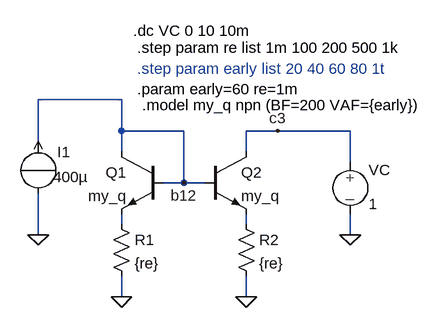
[diagram p0: schematic stromspiegel.asc]
stromspiegel.asc, the LTspice schematic file:
Version 4
SHEET 1 880 680
WIRE 112 0 -16 0
WIRE 112 48 112 0
WIRE 208 48 112 48
WIRE 352 48 304 48
WIRE 464 48 352 48
WIRE -16 64 -16 0
WIRE 112 80 112 48
WIRE 304 80 304 48
WIRE 464 96 464 48
WIRE 208 128 208 48
WIRE 208 128 176 128
WIRE 240 128 208 128
WIRE 112 192 112 176
WIRE 304 192 304 176
WIRE -16 208 -16 144
WIRE 464 208 464 176
WIRE 112 304 112 272
WIRE 304 304 304 272
FLAG 208 128 b12
FLAG 464 208 0
FLAG 352 48 c3
FLAG 304 304 0
FLAG 112 304 0
FLAG -16 208 0
SYMBOL EIT_Semiconductors\\npn 240 80 R0
SYMATTR InstName Q2
SYMATTR Value my_q
SYMBOL source-V 464 80 R0
SYMATTR InstName VC
SYMATTR Value 1
SYMBOL EIT_Semiconductors\\npn 176 80 M0
SYMATTR InstName Q1
SYMATTR Value my_q
SYMBOL source-I -16 64 R0
WINDOW 3 23 55 Left 2
SYMATTR InstName I1
SYMATTR Value 400µ
SYMBOL res 96 176 R0
SYMATTR InstName R1
SYMATTR Value {re}
SYMBOL res 288 176 R0
SYMATTR InstName R2
SYMATTR Value {re}
TEXT 144 8 Left 2 !.model my_q npn (BF=200 VAF={early})
TEXT 136 -16 Left 2 !.param early=60 re=1m
TEXT 136 -48 Left 2 ;.step param early list 20 40 60 80 1t
TEXT 130 -106 Left 2 !.dc VC 0 10 10m
TEXT 136 -80 Left 2 !.step param re list 1m 100 200 500 1k

The netlist it stands for:
* stromspiegel.asc
Q2 c3 b12 N002 0 my_q
VC c3 0 1
Q1 b12 b12 N001 0 my_q
I1 0 b12 400µ
R1 N001 0 {re}
R2 N002 0 {re}
.model NPN NPN
.model PNP PNP
.lib standard.bjt
.model my_q npn (BF=200 VAF={early})
.param early=60 re=1m
* .step param early list 20 40 60 80 1t
.dc VC 0 10 10m
.step param re list 1m 100 200 500 1k
.backanno
.end